# EAGLE schematic BillyBassShield (EAGLE 9.6.2)

## Sheet 1 of 5
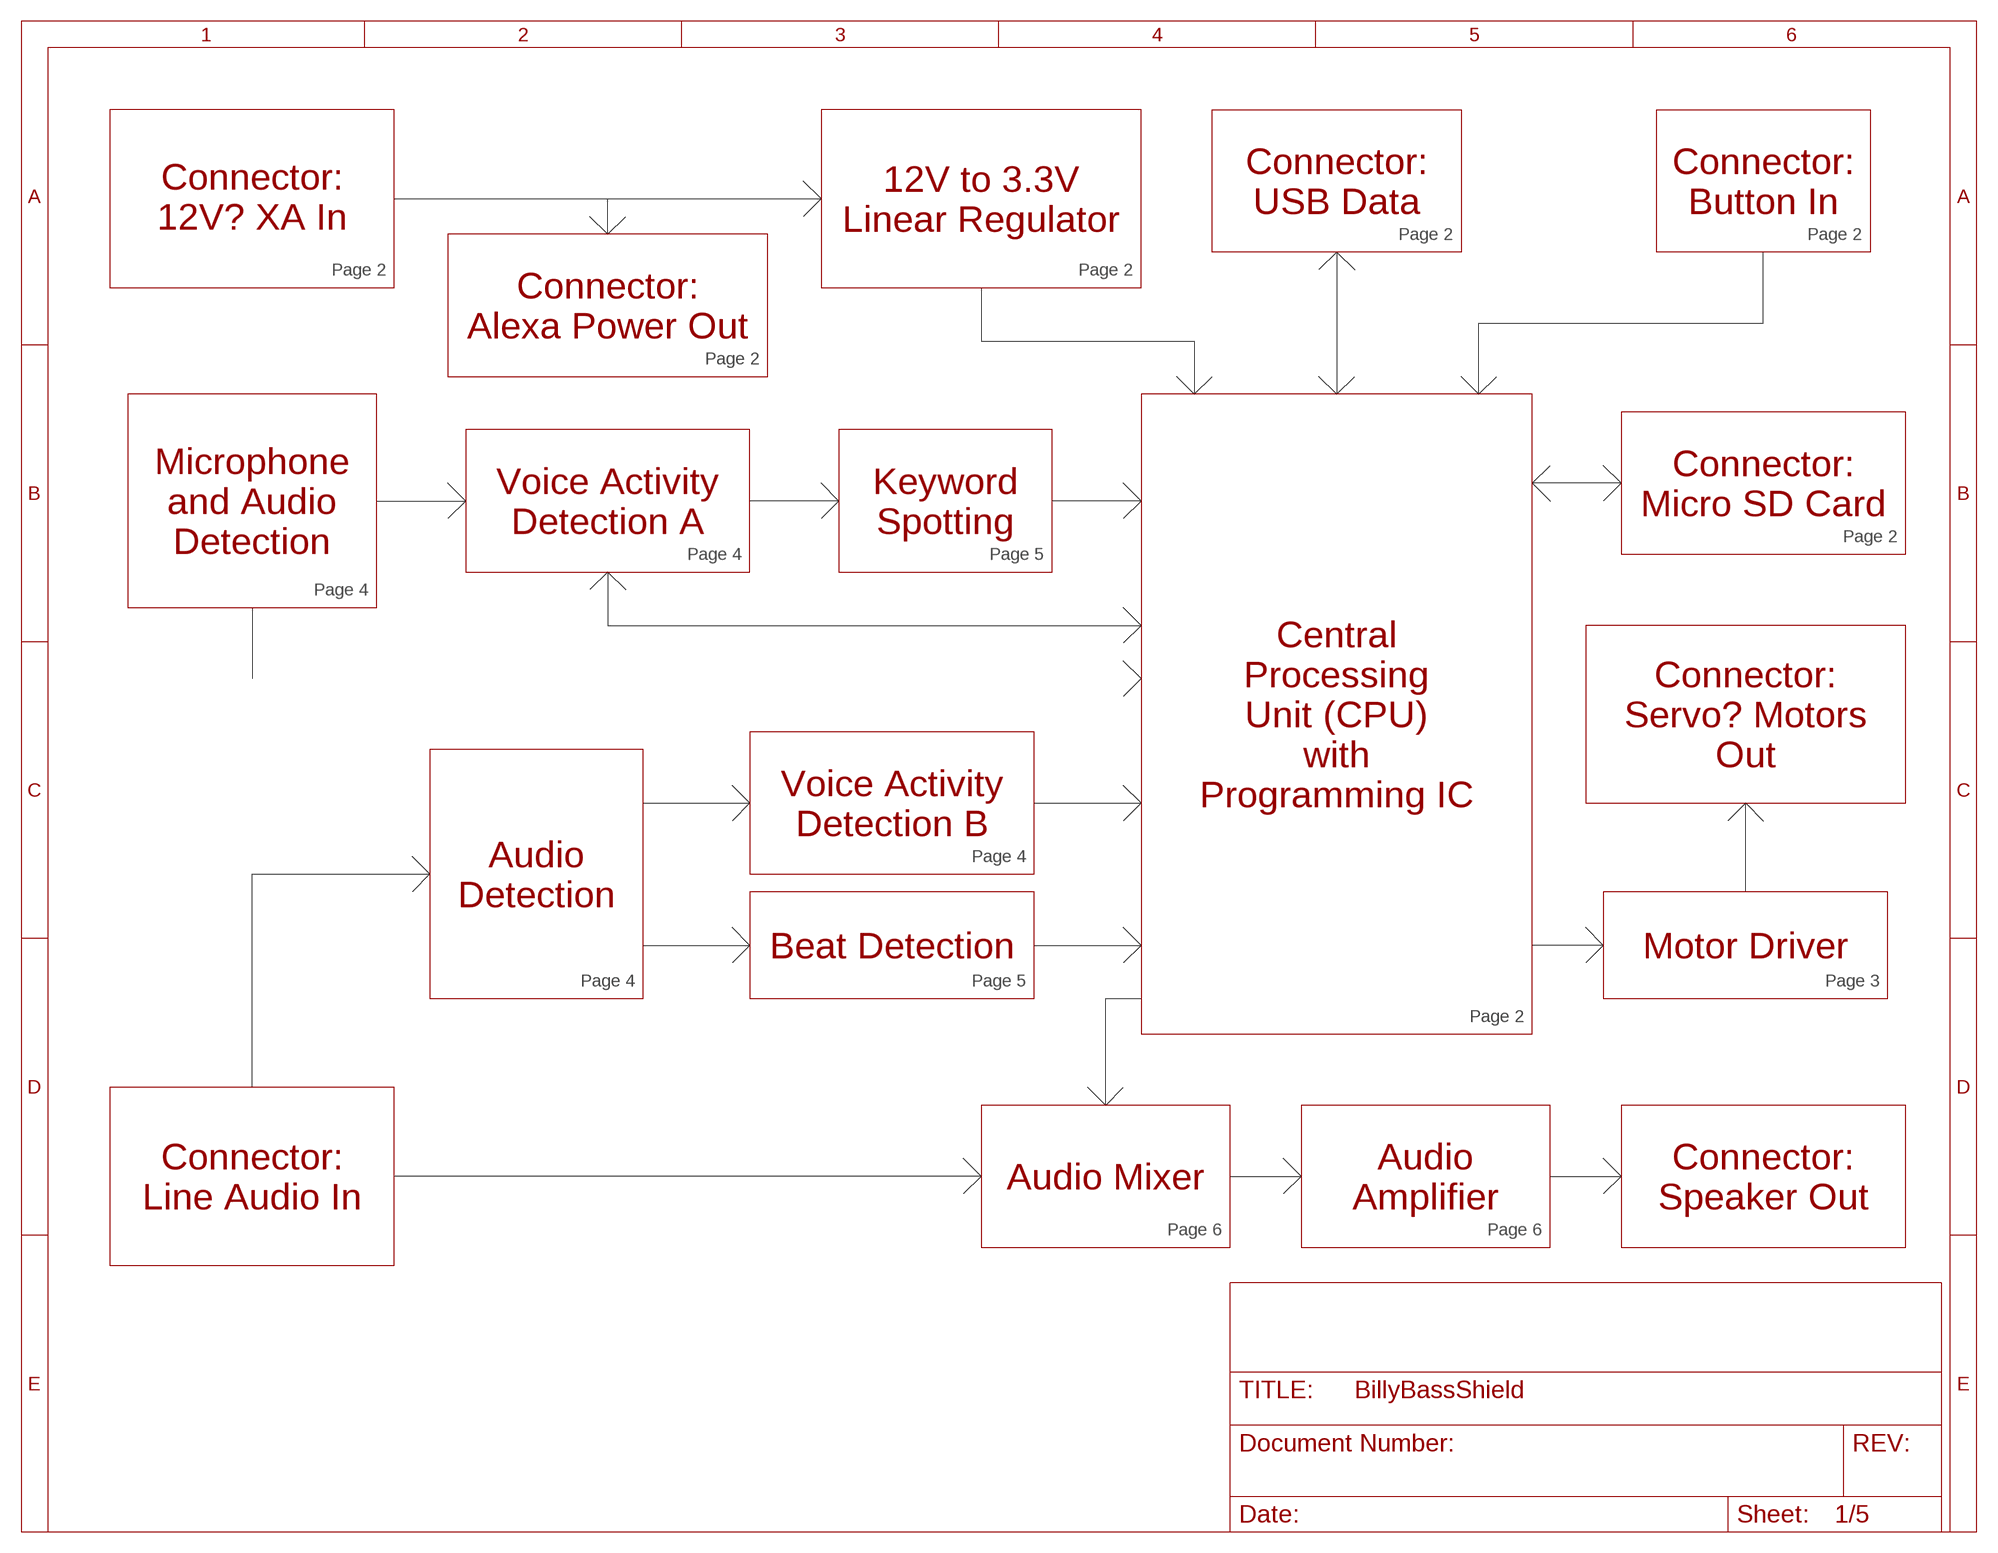
[diagram p0: schematic, sheet 1]

### Notes on the sheet
- Connector:
  USB Data
- Connector:
  Button In
- 12V to 3.3V
  Linear Regulator
- Connector:
  12V? XA In
- Page 2 | Page 2
- Page 2 | Page 2
- Connector:
  Alexa Power Out
- Page 2
- Connector:
  Micro SD Card
- Microphone
  and Audio
  Detection
- Voice Activity
  Detection A
- Keyword
  Spotting
- Page 2
- Page 4 | Page 5
- Page 4
- Central
  Processing
  Unit (CPU)
  with
  Programming IC
- Connector:
  Servo? Motors
  Out
- Voice Activity
  Detection B
- Page 4
- Audio
  Detection
- Beat Detection | Motor Driver
- Page 4 | Page 5 | Page 3
- Page 2
- Connector:
  Line Audio In
- Audio Mixer
- Audio
  Amplifier
- Connector:
  Speaker Out
- Page 6 | Page 6

## Sheet 2 of 5
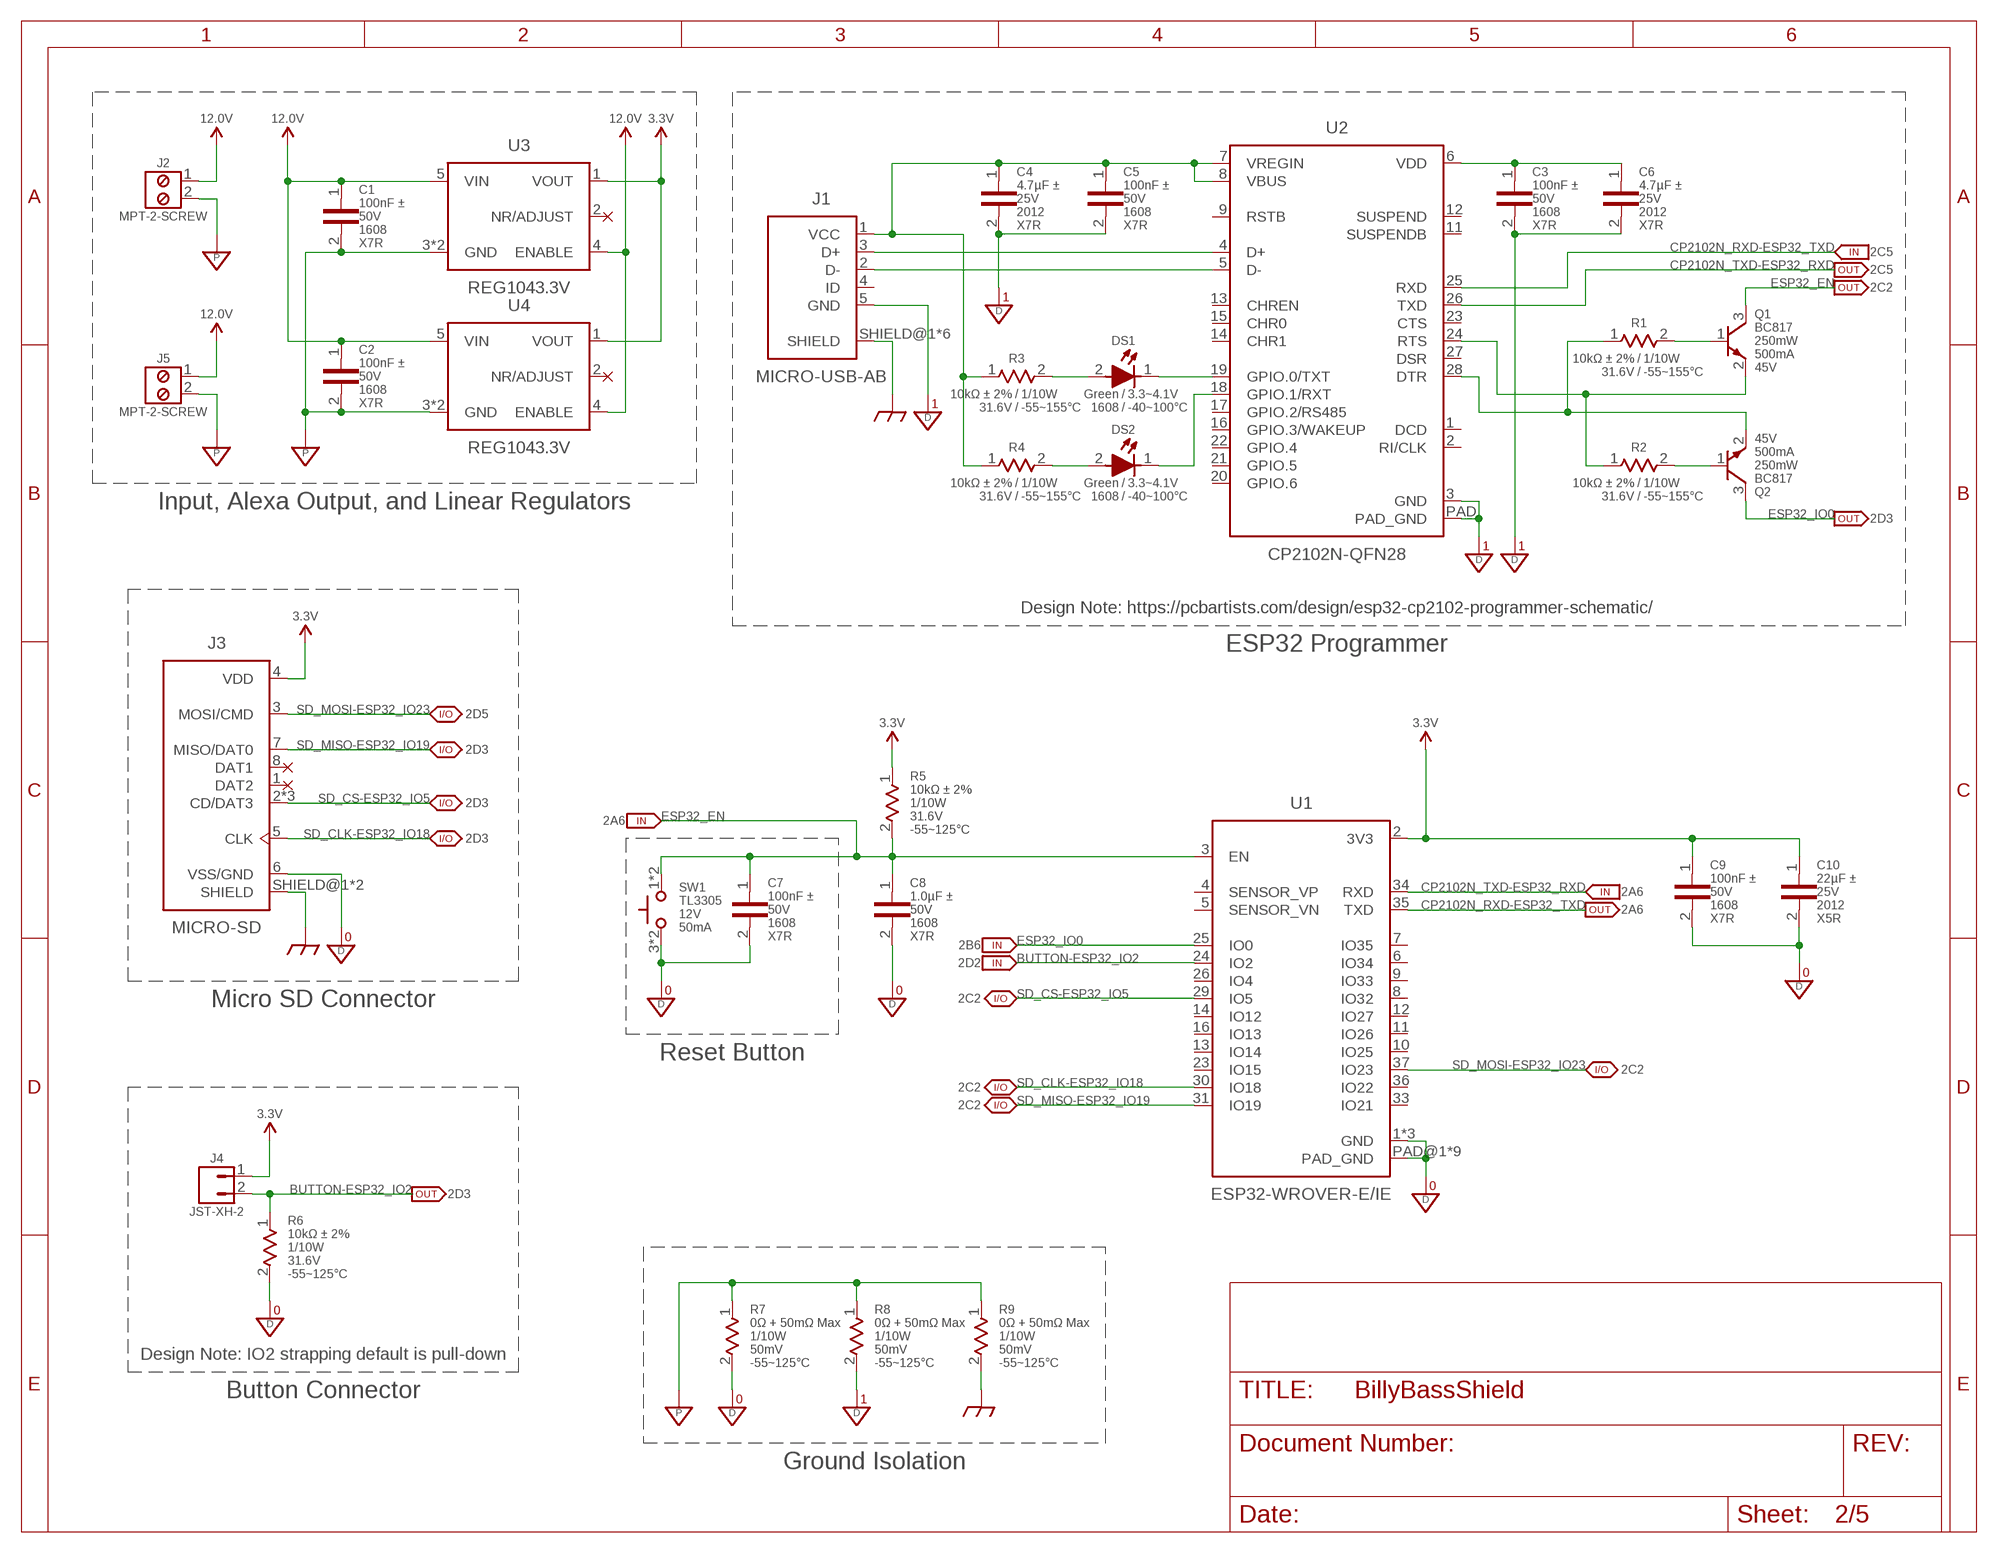
[diagram p1: schematic, sheet 2]

### Parts
C1  100nF ±  CAP-V-100NF-1608  [1608-SEM]
C2  100nF ±  CAP-V-100NF-1608  [1608-SEM]
C3  100nF ±  CAP-V-100NF-1608  [1608-SEM]
C4  4.7µF ±  CAP-V-4.7UF-2012  [2012-SEM]
C5  100nF ±  CAP-V-100NF-1608  [1608-SEM]
C6  4.7µF ±  CAP-V-4.7UF-2012  [2012-SEM]
C7  100nF ±  CAP-V-100NF-1608  [1608-SEM]
C8  1.0µF ±  CAP-V-1.0UF-1608  [1608-SEM]
C9  100nF ±  CAP-V-100NF-1608  [1608-SEM]
C10  22µF ±  CAP-V-22UF-2012  [2012-SEM]
DS1  Green  LED-H-GREEN-1608  [1608]
DS2  Green  LED-H-GREEN-1608  [1608]
J1  MICRO-USB-AB  [47589-0001]
J2  MPT-2-SCREW  [MPT-0.5/2-2.54]
J3  MICRO-SD  [MEM2061]
J4  JST-XH-2  [B2B-XH-A]
J5  MPT-2-SCREW  [MPT-0.5/2-2.54]
Q1  BC817  BJT-NPN-BC817  [SOT-23]
Q2  BC817  BJT-NPN-BC817  [SOT-23]
R1  10kΩ ± 2%  RES-H-10K-1608  [1608-SEM]
R2  10kΩ ± 2%  RES-H-10K-1608  [1608-SEM]
R3  10kΩ ± 2%  RES-H-10K-1608  [1608-SEM]
R4  10kΩ ± 2%  RES-H-10K-1608  [1608-SEM]
R5  10kΩ ± 2%  RES-V-10K-1608  [1608-SEM]
R6  10kΩ ± 2%  RES-V-10K-1608  [1608-SEM]
R7  0Ω + 50mΩ Max  RES-V-0R-1608  [1608-SEM]
R8  0Ω + 50mΩ Max  RES-V-0R-1608  [1608-SEM]
R9  0Ω + 50mΩ Max  RES-V-0R-1608  [1608-SEM]
SW1  TL3305  BUTTON-V-SPST-TL3305  [TL3305]
U1  ESP32-WROVER-E/IE  [ESP32-WROVER-E/IE]
U2  CP2102N-QFN28  [QFN28]
U3  REG1043.3V  [KTT]
U4  REG1043.3V  [KTT]

### Nets
3.3V: C9.1 C10.1 J3.4(VDD) J4.1 R5.1 U1.2(3V3) U3.1(VOUT) U4.1(VOUT)
12.0V: C1.1 C2.1 J2.1 J5.1 U3.4(ENABLE) U3.5(VIN) U4.4(ENABLE) U4.5(VIN)
BUTTON-ESP32_IO2: J4.2 R6.1 U1.24(IO2)
CHASSIS: J1.SHIELD@1(SHIELD) J1.SHIELD@2(SHIELD) J1.SHIELD@3(SHIELD) J1.SHIELD@4(SHIELD) J1.SHIELD@5(SHIELD) J1.SHIELD@6(SHIELD) J3.SHIELD@1(SHIELD) J3.SHIELD@2(SHIELD) R9.2
CP2102N_D+: J1.3(D+) U2.4(D+)
CP2102N_D-: J1.2(D-) U2.5(D-)
CP2102N_DTR: Q2.2(E) R1.1 U2.28(DTR)
CP2102N_RTS: Q1.2(E) R2.1 U2.24(RTS)
CP2102N_RXD-ESP32_TXD: U1.35(TXD) U2.25(RXD)
CP2102N_TXD-ESP32_RXD: U1.34(RXD) U2.26(TXD)
CP2102N_VBUS: C4.1 C5.1 J1.1(VCC) R3.1 R4.1 U2.7(VREGIN) U2.8(VBUS)
CP2102N_VDD: C3.1 C6.1 U2.6(VDD)
DGND-0: C7.2 C8.2 C9.2 C10.2 J3.6(VSS/GND) R6.2 R7.2 SW1.3 SW1.4 U1.1(GND) U1.15(GND) U1.38(GND) U1.PAD@1(PAD_GND) U1.PAD@2(PAD_GND) U1.PAD@3(PAD_GND) U1.PAD@4(PAD_GND) U1.PAD@5(PAD_GND) U1.PAD@6(PAD_GND) U1.PAD@7(PAD_GND) U1.PAD@8(PAD_GND) U1.PAD@9(PAD_GND)
DGND-1: C3.2 C4.2 C5.2 C6.2 J1.5(GND) R8.2 U2.3(GND) U2.PAD(PAD_GND)
ESP32_EN: C7.1 C8.1 Q1.3(C) R5.2 SW1.1 SW1.2 U1.3(EN)
ESP32_IO0: Q2.3(C) U1.25(IO0)
N$1: DS1.1 U2.19(GPIO.0/TXT)
N$2: DS2.1 U2.18(GPIO.1/RXT)
N$3: Q1.1(B) R1.2
N$4: Q2.1(B) R2.2
N$5: DS1.2 R3.2
N$6: DS2.2 R4.2
PGND: C1.2 C2.2 J2.2 J5.2 R7.1 R8.1 R9.1 U3.3(GND) U3.PAD(GND) U4.3(GND) U4.PAD(GND)
SD_CLK-ESP32_IO18: J3.5(CLK) U1.30(IO18)
SD_CS-ESP32_IO5: J3.2(CD/DAT3) J3.CD@1(CD/DAT3) J3.CD@2(CD/DAT3) U1.29(IO5)
SD_MISO-ESP32_IO19: J3.7(MISO/DAT0) U1.31(IO19)
SD_MOSI-ESP32_IO23: J3.3(MOSI/CMD) U1.37(IO23)
Unconnected: J1.4(ID) J3.1(DAT2) J3.8(DAT1) U1.4(SENSOR_VP) U1.5(SENSOR_VN) U1.6(IO34) U1.7(IO35) U1.8(IO32) U1.9(IO33) U1.10(IO25) U1.11(IO26) U1.12(IO27) U1.13(IO14) U1.14(IO12) U1.16(IO13) U1.23(IO15) U1.26(IO4) U1.33(IO21) U1.36(IO22) U2.1(DCD) U2.2(RI/CLK) U2.9(RSTB) U2.11(SUSPENDB) U2.12(SUSPEND) U2.13(CHREN) U2.14(CHR1) U2.15(CHR0) U2.16(GPIO.3/WAKEUP) U2.17(GPIO.2/RS485) U2.20(GPIO.6) U2.21(GPIO.5) U2.22(GPIO.4) U2.23(CTS) U2.27(DSR) U3.2(NR/ADJUST) U4.2(NR/ADJUST)

### Notes on the sheet
- 2C5
- 2C5
- 2C2
- Input, Alexa Output, and Linear Regulators
- 2D3
- Design Note: https://pcbartists.com/design/esp32-cp2102-programmer-schematic/
- ESP32 Programmer
- 2D5
- 2D3
- 2D3
- 2A6
- 2D3
- 2A6
- 2A6
- 2B6
- 2D2
- Micro SD Connector | 2C2
- Reset Button
- 2C2
- 2C2
- 2C2
- 2D3
- Design Note: IO2 strapping default is pull-down
- Button Connector
- Ground Isolation

## Sheet 3 of 5
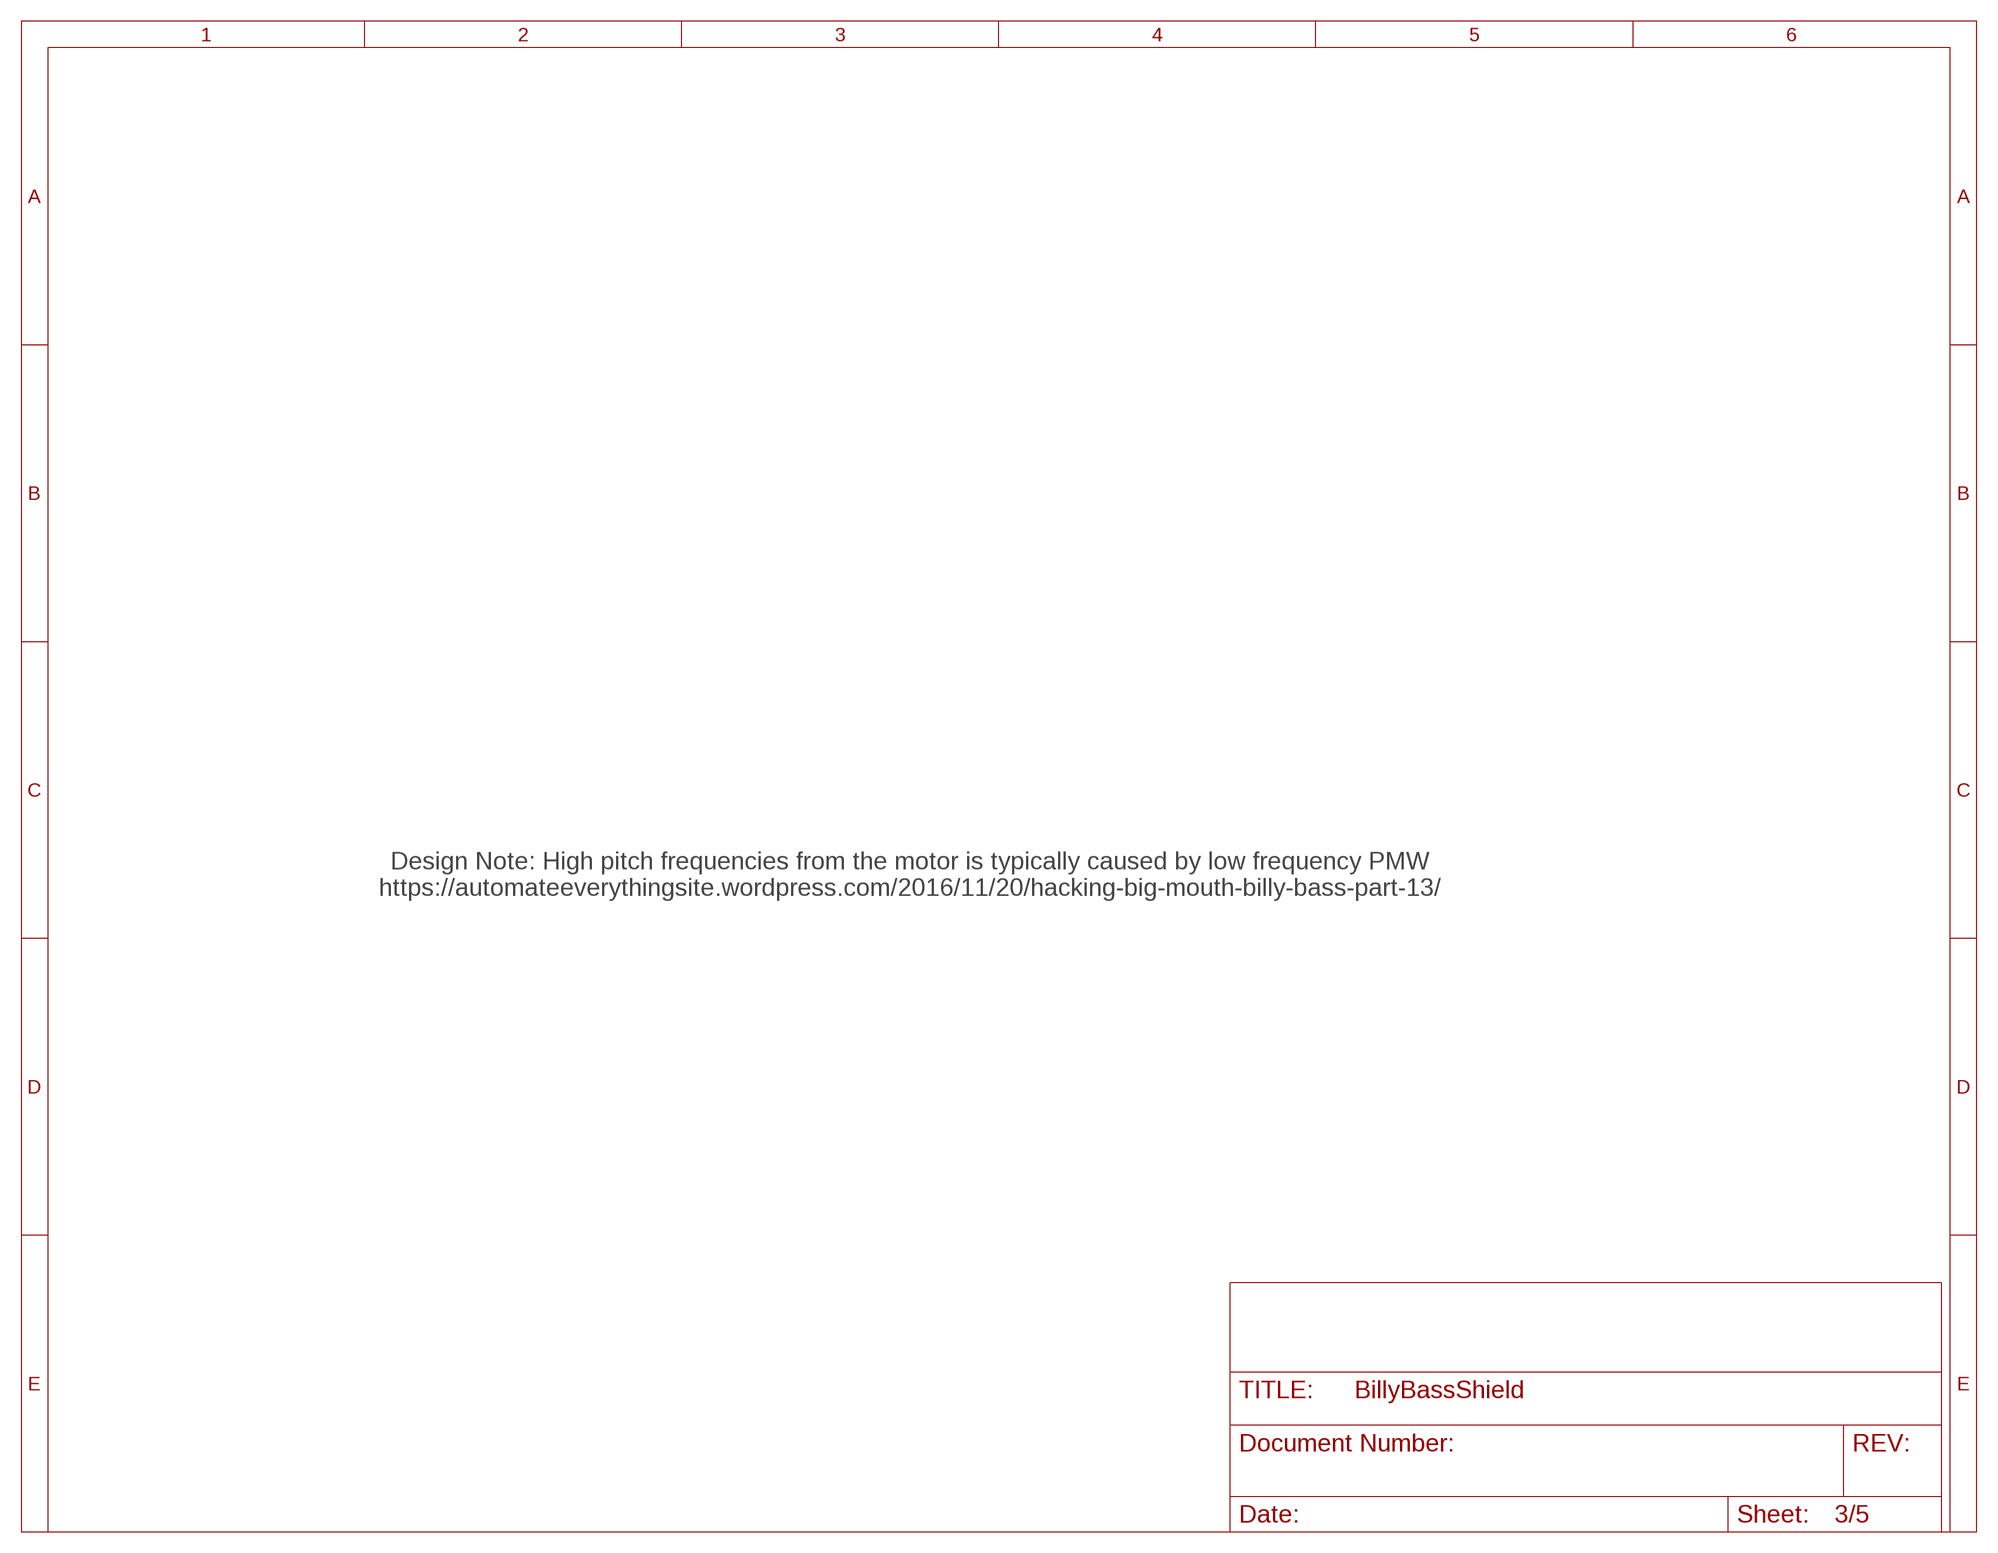
[diagram p2: schematic, sheet 3]

### Notes on the sheet
- Design Note: High pitch frequencies from the motor is typically caused by low frequency PMW
  https://automateeverythingsite.wordpress.com/2016/11/20/hacking-big-mouth-billy-bass-part-13/

## Sheet 4 of 5
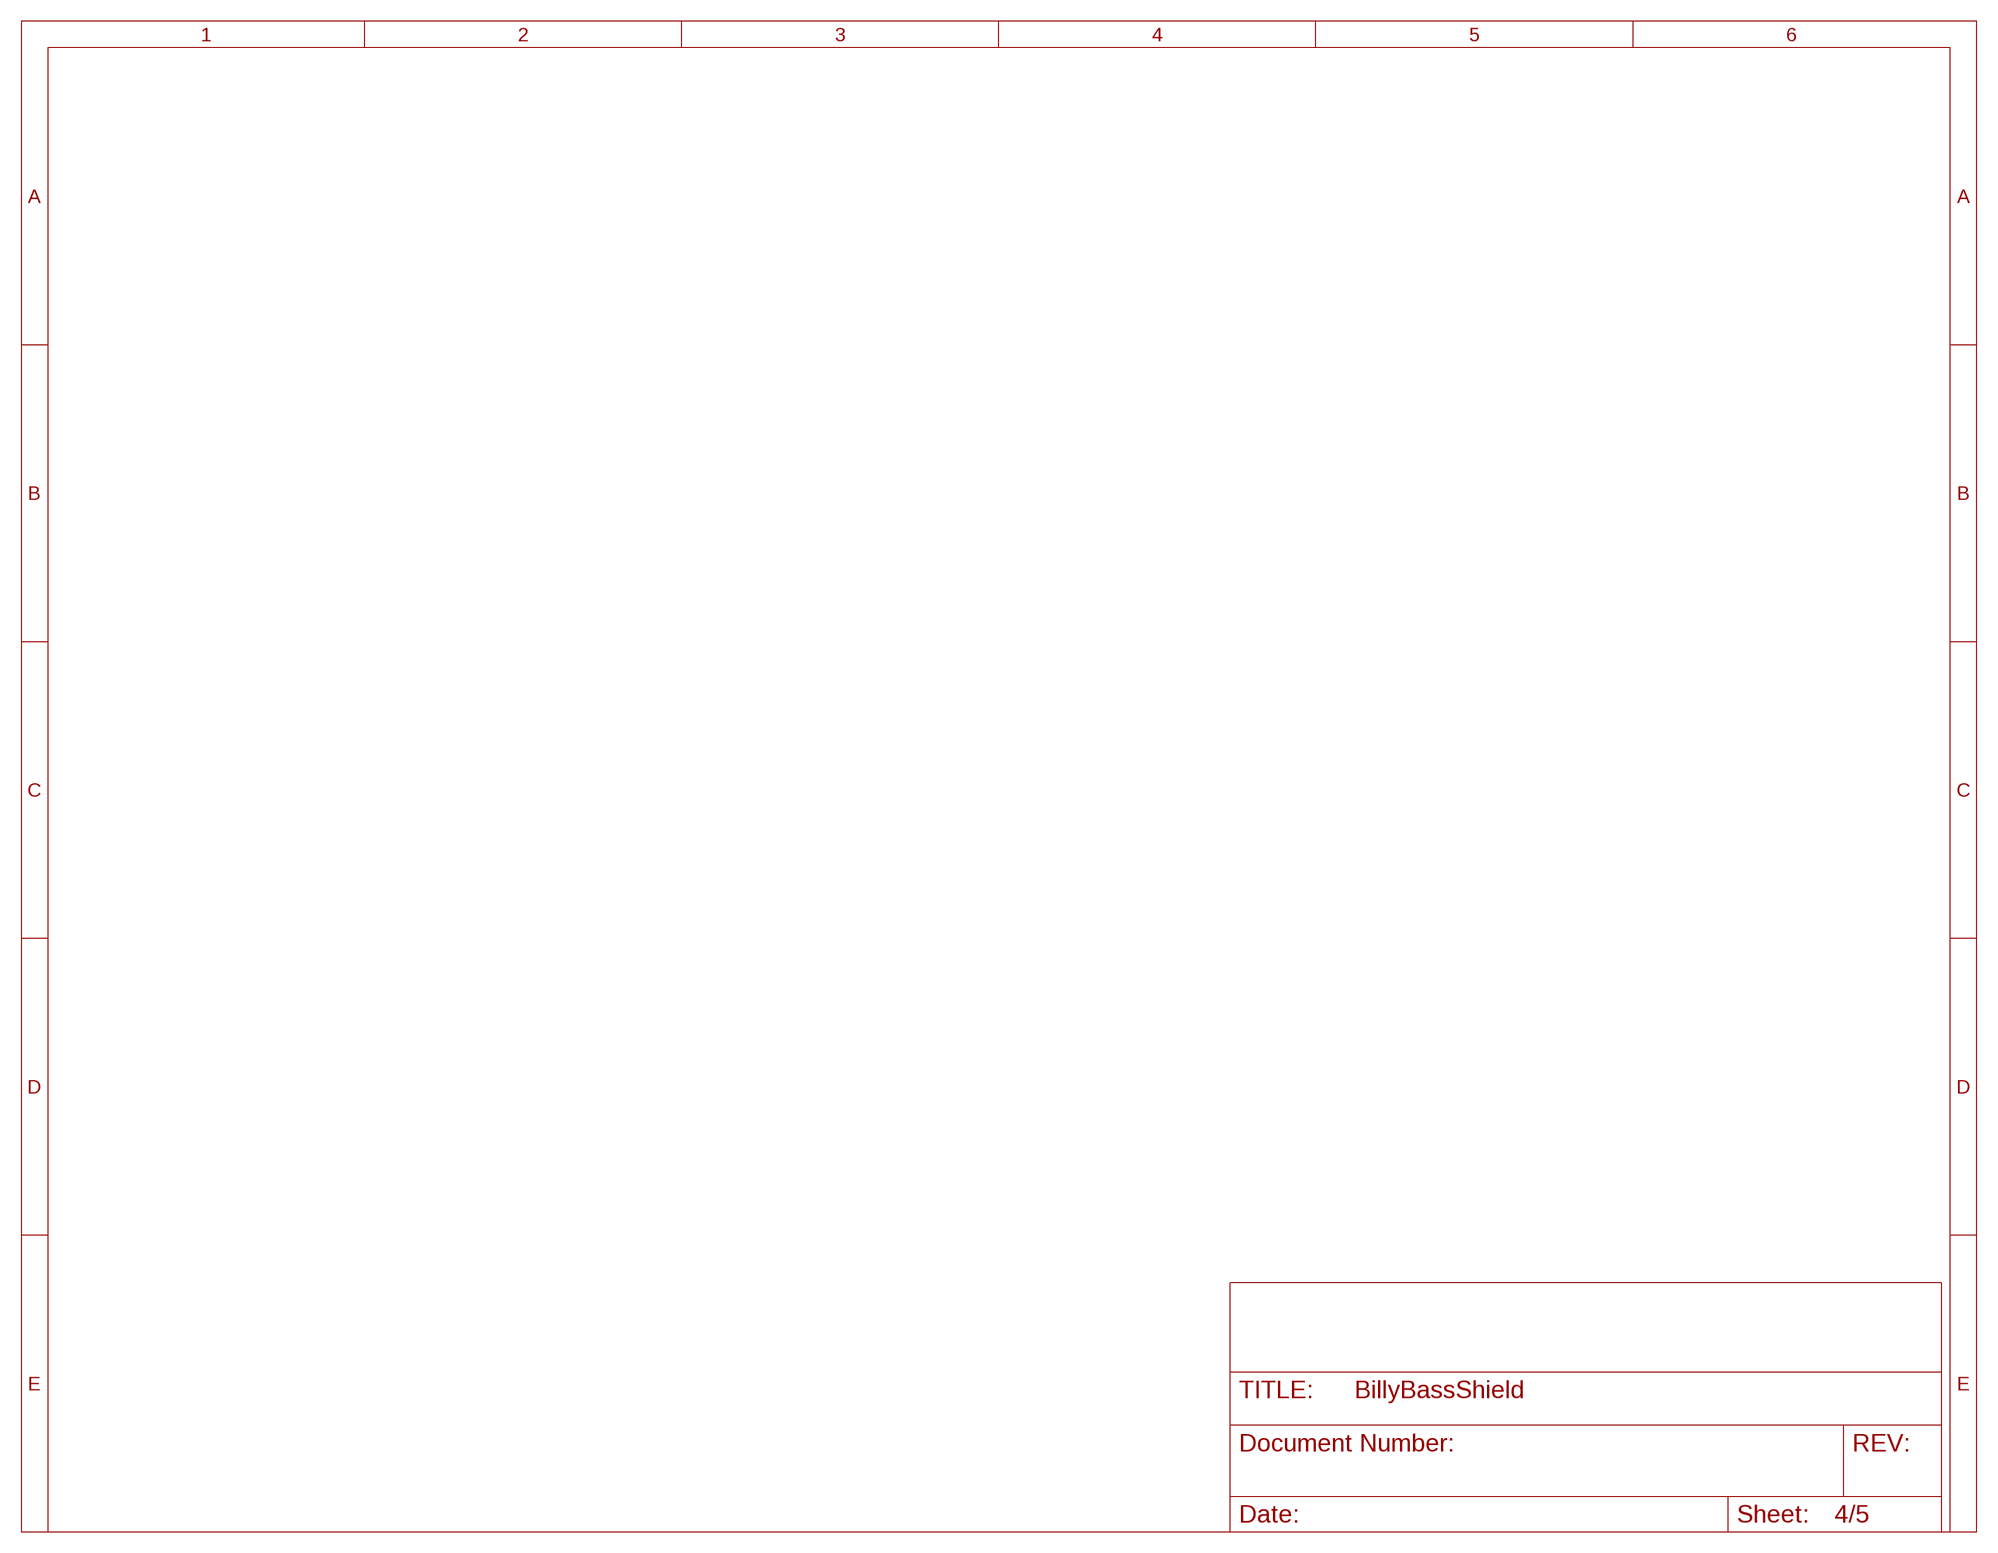
[diagram p3: schematic, sheet 4]

## Sheet 5 of 5
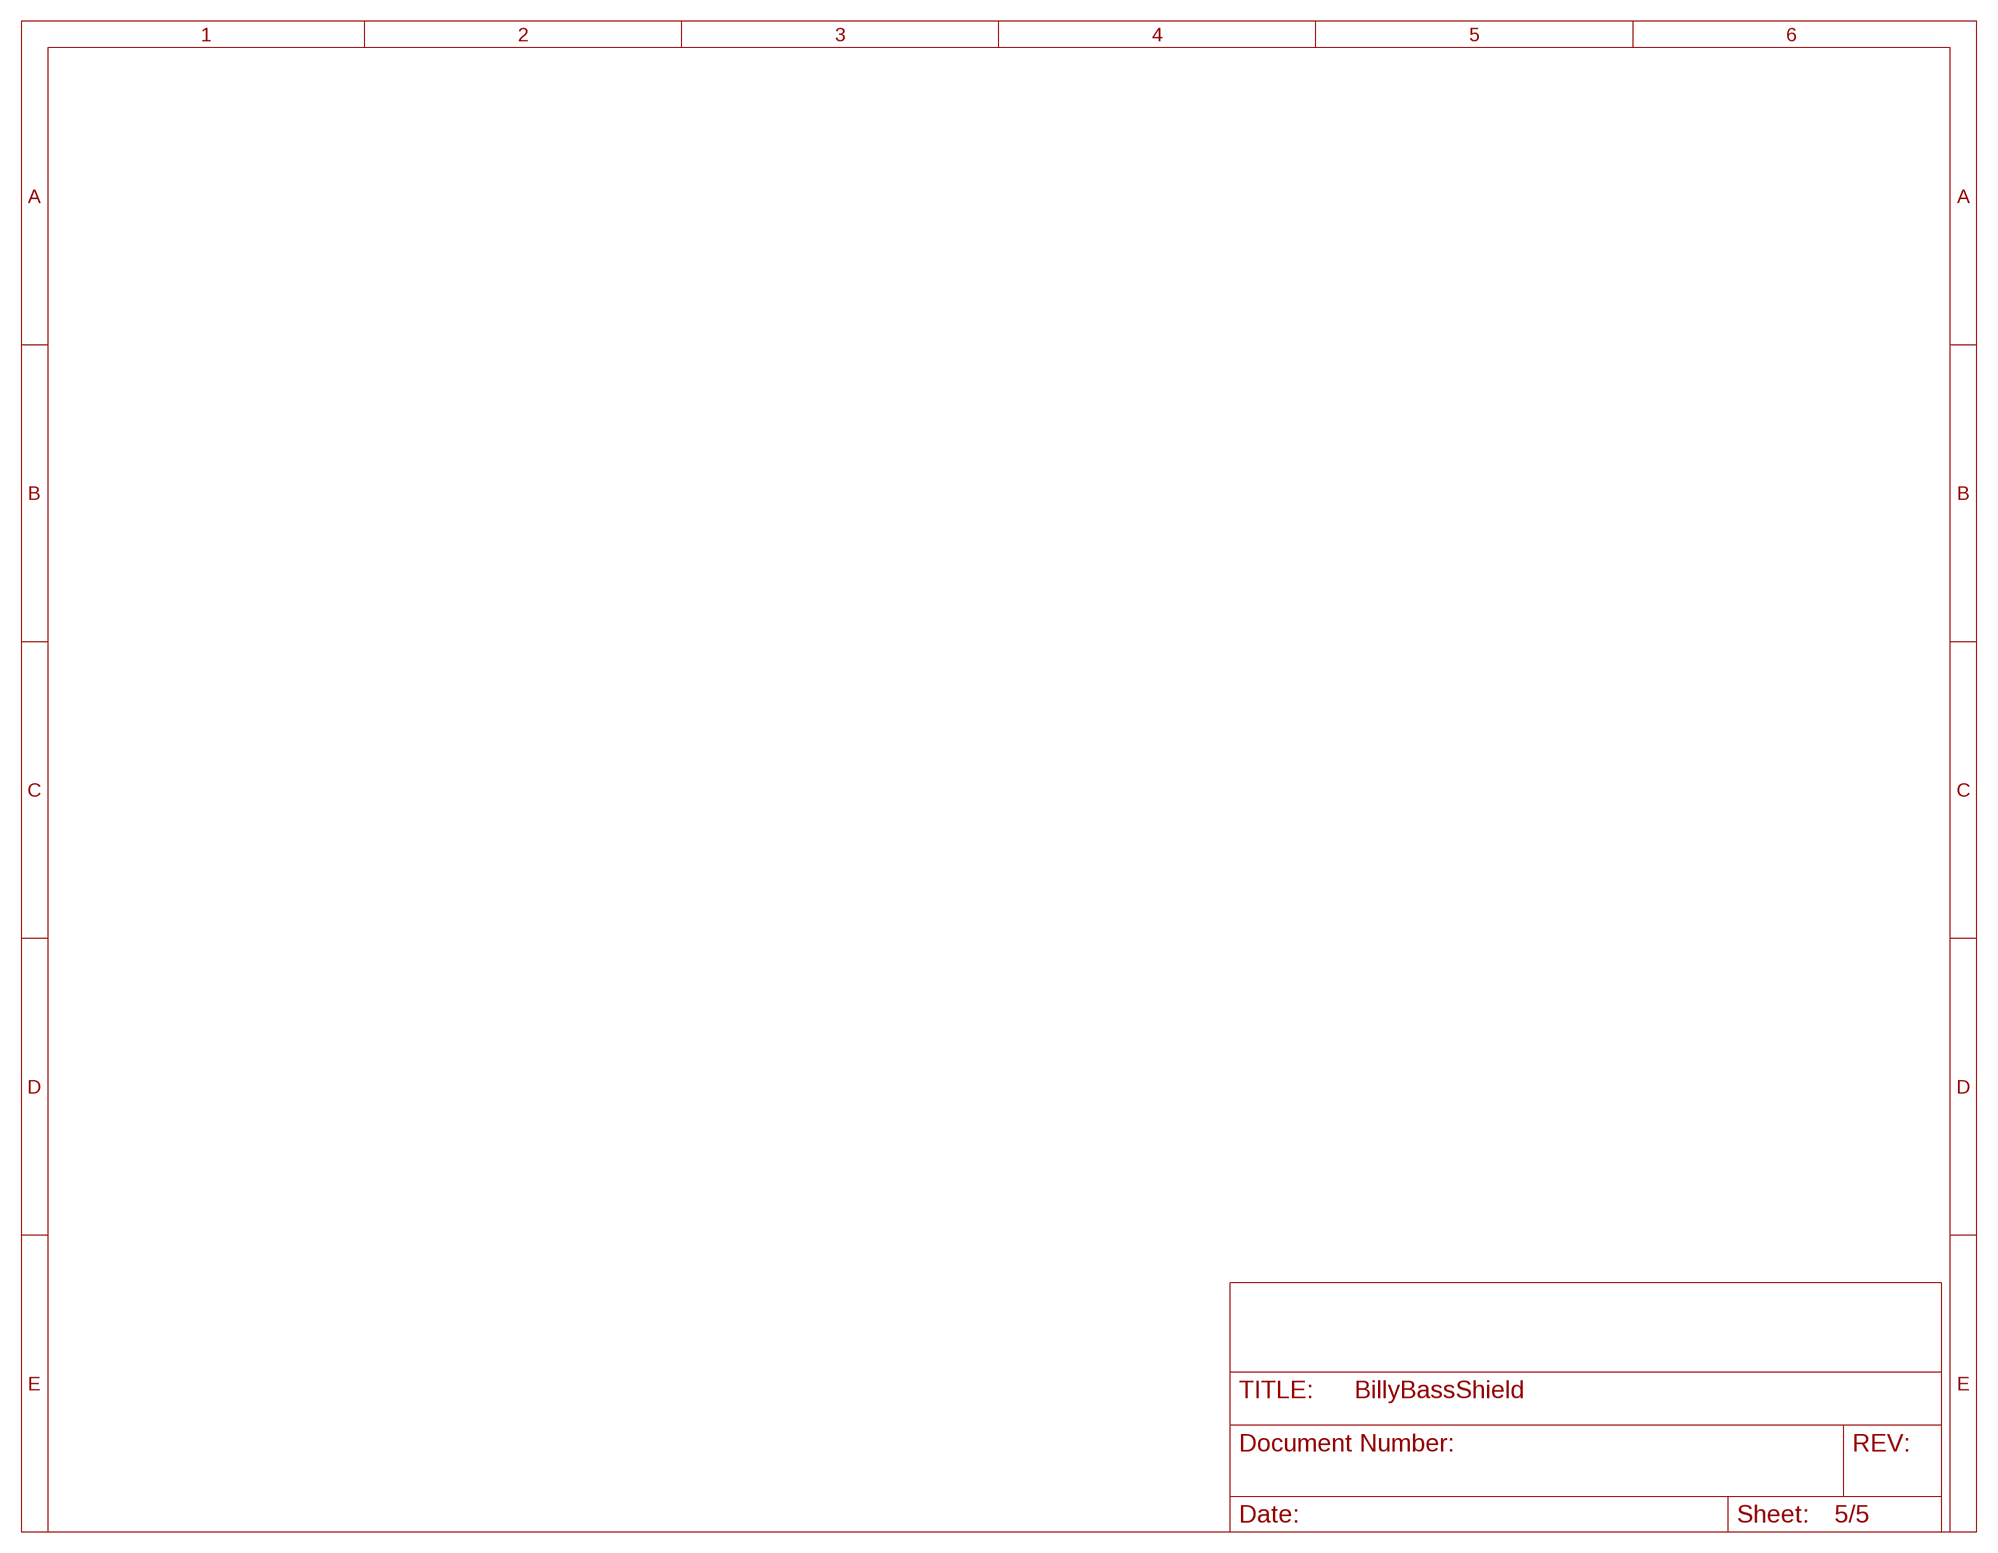
[diagram p4: schematic, sheet 5]

## Library data of the parts
C1-C3 C5 C7-C9 = Harrington-Capacitors:CAP-V: Ceramic Capacitors - Vertical; SIZE: 1608; TEMPERATURE: X7R; VOLTAGE: 50V
C4 C6 = Harrington-Capacitors:CAP-V: Ceramic Capacitors - Vertical; SIZE: 2012; TEMPERATURE: X7R; VOLTAGE: 25V
C10 = Harrington-Capacitors:CAP-V: Ceramic Capacitors - Vertical; SIZE: 2012; TEMPERATURE: X5R; VOLTAGE: 25V
DS1 DS2 = Harrington-LEDs:LED-H: LEDs Kingbright - Horizontal; SIZE: 1608; TEMPERATURE: -40~100°C; VOLTAGE: 3.3~4.1V
J1 = Harrington-Connectors:MICRO-USB-AB: Micro USB AB Molex
J2 J5 = Harrington-Connectors:MPT-2-SCREW: 2-pin MPT Screw Connector Phoenix Contact - Max Voltage: 160V - Max Current: 6A
J3 = Harrington-Connectors:MICRO-SD: Micro-SD Connector GCT - CD = GND when not inserted
J4 = Harrington-Connectors:JST-XH-2: 2-pin XH Connector JST - Max Voltage: 250V - Max Current: 3A
Q1 Q2 = Harrington-Transistors:BJT-NPN: NPN BJTs; IC_MAX: 500mA; POWER: 250mW; VCE_MAX: 45V
R1-R4 = Harrington-Resistors:RES-H: Resistors - Horizontal; POWER: 1/10W; TEMPERATURE: -55~155°C; VOLTAGE: 31.6V
R5 R6 = Harrington-Resistors:RES-V: Resistors - Vertical; POWER: 1/10W; TEMPERATURE: -55~125°C; VOLTAGE: 31.6V
R7-R9 = Harrington-Resistors:RES-V: Resistors - Vertical; POWER: 1/10W; TEMPERATURE: -55~125°C; VOLTAGE: 50mV
SW1 = Harrington-Switches:BUTTON-V-SPST: SPST Button E-Switch - Vertical; I_MAX: 50mA; V_MAX: 12V
U1 = Harrington-ICs:ESP32-WROVER-E/IE: ESP32-WROVER-E/IE Espressif - ESP32 with 8MB PSRAM
U2 = Harrington-ICs:CP2102N-QFN28: CP2102N QFN28 Silicon Labs - CP2102N 28 pin variant with TXT and RXT
U3 U4 = Harrington-ICs:REG104: REG104 Linear Regulator Texas Instruments (Burr-Brown Products) - Max Power Dissipation: - DDPAK: 3.7W - SOT-223: 2W